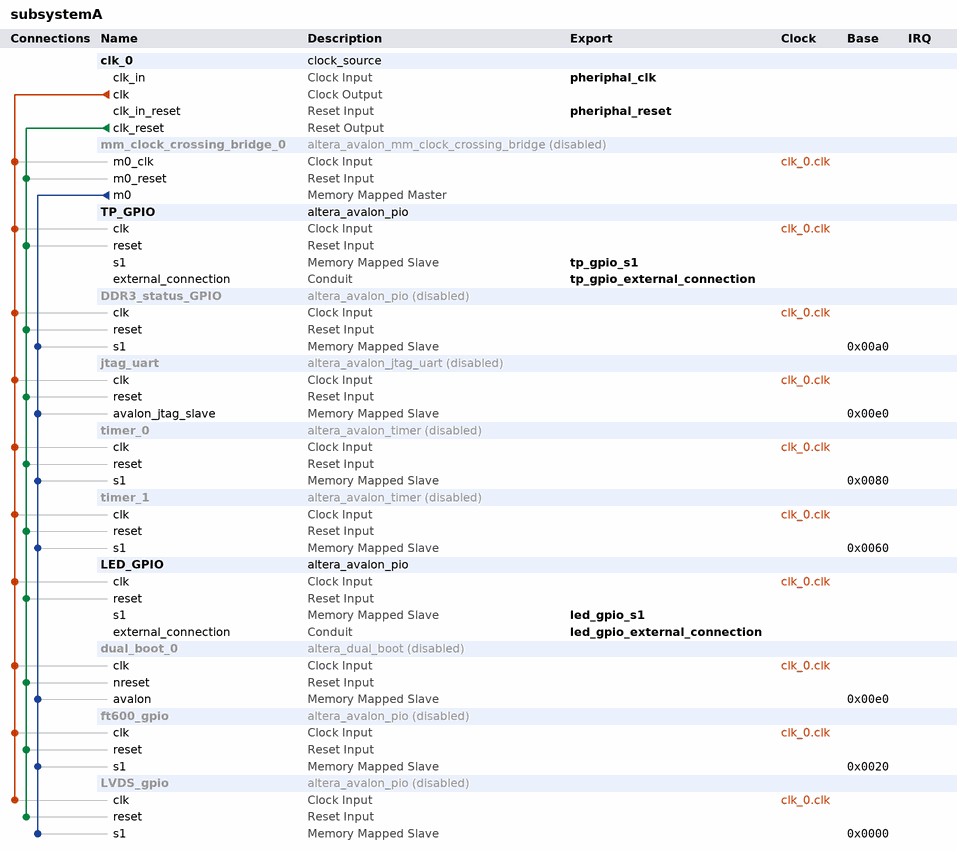
[diagram p0: system contents]
# Platform Designer (Qsys) system subsystemA, MAX 10 10M50DAF484I7G
# Parameters at their usual value, and those the tool derives, are not listed.
package require -exact qsys 18.1
create_system subsystemA
set_project_property DEVICE_FAMILY {MAX 10}
set_project_property DEVICE 10M50DAF484I7G

add_instance clk_0 clock_source 18.1
set_instance_parameter_value clk_0 clockFrequency 50000000

add_instance mm_clock_crossing_bridge_0 altera_avalon_mm_clock_crossing_bridge 18.1
set_instance_property mm_clock_crossing_bridge_0 ENABLED false
set_instance_parameter_value mm_clock_crossing_bridge_0 ADDRESS_WIDTH 10
set_instance_parameter_value mm_clock_crossing_bridge_0 COMMAND_FIFO_DEPTH 4
set_instance_parameter_value mm_clock_crossing_bridge_0 DATA_WIDTH 32
set_instance_parameter_value mm_clock_crossing_bridge_0 MASTER_SYNC_DEPTH 2
set_instance_parameter_value mm_clock_crossing_bridge_0 MAX_BURST_SIZE 1
set_instance_parameter_value mm_clock_crossing_bridge_0 RESPONSE_FIFO_DEPTH 4
set_instance_parameter_value mm_clock_crossing_bridge_0 SLAVE_SYNC_DEPTH 2
set_instance_parameter_value mm_clock_crossing_bridge_0 USE_AUTO_ADDRESS_WIDTH 1

add_instance TP_GPIO altera_avalon_pio 18.1
set_instance_parameter_value TP_GPIO bitModifyingOutReg true
set_instance_parameter_value TP_GPIO direction Output
set_instance_parameter_value TP_GPIO width 8

add_instance DDR3_status_GPIO altera_avalon_pio 18.1
set_instance_property DDR3_status_GPIO ENABLED false
set_instance_parameter_value DDR3_status_GPIO bitModifyingOutReg true
set_instance_parameter_value DDR3_status_GPIO direction Input
set_instance_parameter_value DDR3_status_GPIO width 4

add_instance jtag_uart altera_avalon_jtag_uart 18.1
set_instance_property jtag_uart ENABLED false
set_instance_parameter_value jtag_uart simInteractiveOptions NO_INTERACTIVE_WINDOWS
set_instance_parameter_value jtag_uart writeBufferDepth 4096

add_instance timer_0 altera_avalon_timer 18.1
set_instance_property timer_0 ENABLED false
set_instance_parameter_value timer_0 period 1
set_instance_parameter_value timer_0 periodUnits MSEC

add_instance timer_1 altera_avalon_timer 18.1
set_instance_property timer_1 ENABLED false
set_instance_parameter_value timer_1 period 1
set_instance_parameter_value timer_1 periodUnits MSEC

add_instance LED_GPIO altera_avalon_pio 18.1
set_instance_parameter_value LED_GPIO bitModifyingOutReg true
set_instance_parameter_value LED_GPIO direction InOut
set_instance_parameter_value LED_GPIO simDoTestBenchWiring true
set_instance_parameter_value LED_GPIO width 8

add_instance dual_boot_0 altera_dual_boot 18.1
set_instance_property dual_boot_0 ENABLED false
set_instance_parameter_value dual_boot_0 CLOCK_FREQUENCY 50.0

add_instance ft600_gpio altera_avalon_pio 18.1
set_instance_property ft600_gpio ENABLED false
set_instance_parameter_value ft600_gpio bitModifyingOutReg true
set_instance_parameter_value ft600_gpio captureEdge true
set_instance_parameter_value ft600_gpio direction InOut
set_instance_parameter_value ft600_gpio edgeType FALLING
set_instance_parameter_value ft600_gpio generateIRQ true
set_instance_parameter_value ft600_gpio irqType EDGE
set_instance_parameter_value ft600_gpio width 4

add_instance LVDS_gpio altera_avalon_pio 18.1
set_instance_property LVDS_gpio ENABLED false
set_instance_parameter_value LVDS_gpio bitModifyingOutReg true
set_instance_parameter_value LVDS_gpio captureEdge true
set_instance_parameter_value LVDS_gpio direction InOut
set_instance_parameter_value LVDS_gpio edgeType FALLING
set_instance_parameter_value LVDS_gpio generateIRQ true
set_instance_parameter_value LVDS_gpio irqType EDGE
set_instance_parameter_value LVDS_gpio width 4

# connections
add_connection clk_0.clk DDR3_status_GPIO.clk clock
add_connection clk_0.clk dual_boot_0.clk clock
add_connection clk_0.clk ft600_gpio.clk clock
add_connection clk_0.clk jtag_uart.clk clock
add_connection clk_0.clk LED_GPIO.clk clock
add_connection clk_0.clk LVDS_gpio.clk clock
add_connection clk_0.clk mm_clock_crossing_bridge_0.m0_clk clock
add_connection clk_0.clk timer_0.clk clock
add_connection clk_0.clk timer_1.clk clock
add_connection clk_0.clk TP_GPIO.clk clock
add_connection clk_0.clk_reset DDR3_status_GPIO.reset reset
add_connection clk_0.clk_reset dual_boot_0.nreset reset
add_connection clk_0.clk_reset ft600_gpio.reset reset
add_connection clk_0.clk_reset jtag_uart.reset reset
add_connection clk_0.clk_reset LED_GPIO.reset reset
add_connection clk_0.clk_reset LVDS_gpio.reset reset
add_connection clk_0.clk_reset mm_clock_crossing_bridge_0.m0_reset reset
add_connection clk_0.clk_reset timer_0.reset reset
add_connection clk_0.clk_reset timer_1.reset reset
add_connection clk_0.clk_reset TP_GPIO.reset reset
add_connection mm_clock_crossing_bridge_0.m0 DDR3_status_GPIO.s1 avalon
set_connection_parameter_value mm_clock_crossing_bridge_0.m0/DDR3_status_GPIO.s1 baseAddress 0x00a0
add_connection mm_clock_crossing_bridge_0.m0 dual_boot_0.avalon avalon
set_connection_parameter_value mm_clock_crossing_bridge_0.m0/dual_boot_0.avalon baseAddress 0x00e0
add_connection mm_clock_crossing_bridge_0.m0 ft600_gpio.s1 avalon
set_connection_parameter_value mm_clock_crossing_bridge_0.m0/ft600_gpio.s1 baseAddress 0x0020
add_connection mm_clock_crossing_bridge_0.m0 jtag_uart.avalon_jtag_slave avalon
set_connection_parameter_value mm_clock_crossing_bridge_0.m0/jtag_uart.avalon_jtag_slave baseAddress 0x00e0
add_connection mm_clock_crossing_bridge_0.m0 LVDS_gpio.s1 avalon
set_connection_parameter_value mm_clock_crossing_bridge_0.m0/LVDS_gpio.s1 baseAddress 0x0000
add_connection mm_clock_crossing_bridge_0.m0 timer_0.s1 avalon
set_connection_parameter_value mm_clock_crossing_bridge_0.m0/timer_0.s1 baseAddress 0x0080
add_connection mm_clock_crossing_bridge_0.m0 timer_1.s1 avalon
set_connection_parameter_value mm_clock_crossing_bridge_0.m0/timer_1.s1 baseAddress 0x0060

# exported interfaces
add_interface led_gpio_external_connection conduit end
set_interface_property led_gpio_external_connection EXPORT_OF LED_GPIO.external_connection
add_interface led_gpio_s1 avalon slave
set_interface_property led_gpio_s1 EXPORT_OF LED_GPIO.s1
add_interface pheriphal_clk clock sink
set_interface_property pheriphal_clk EXPORT_OF clk_0.clk_in
add_interface pheriphal_reset reset sink
set_interface_property pheriphal_reset EXPORT_OF clk_0.clk_in_reset
add_interface tp_gpio_external_connection conduit end
set_interface_property tp_gpio_external_connection EXPORT_OF TP_GPIO.external_connection
add_interface tp_gpio_s1 avalon slave
set_interface_property tp_gpio_s1 EXPORT_OF TP_GPIO.s1

set_interconnect_requirement {$system} qsys_mm.clockCrossingAdapter HANDSHAKE
set_interconnect_requirement {$system} qsys_mm.enableEccProtection FALSE
set_interconnect_requirement {$system} qsys_mm.insertDefaultSlave FALSE
set_interconnect_requirement {$system} qsys_mm.maxAdditionalLatency 1

save_system subsystemA.qsys
